# Altium schematic sheet Sheet1.SchDoc
size A3
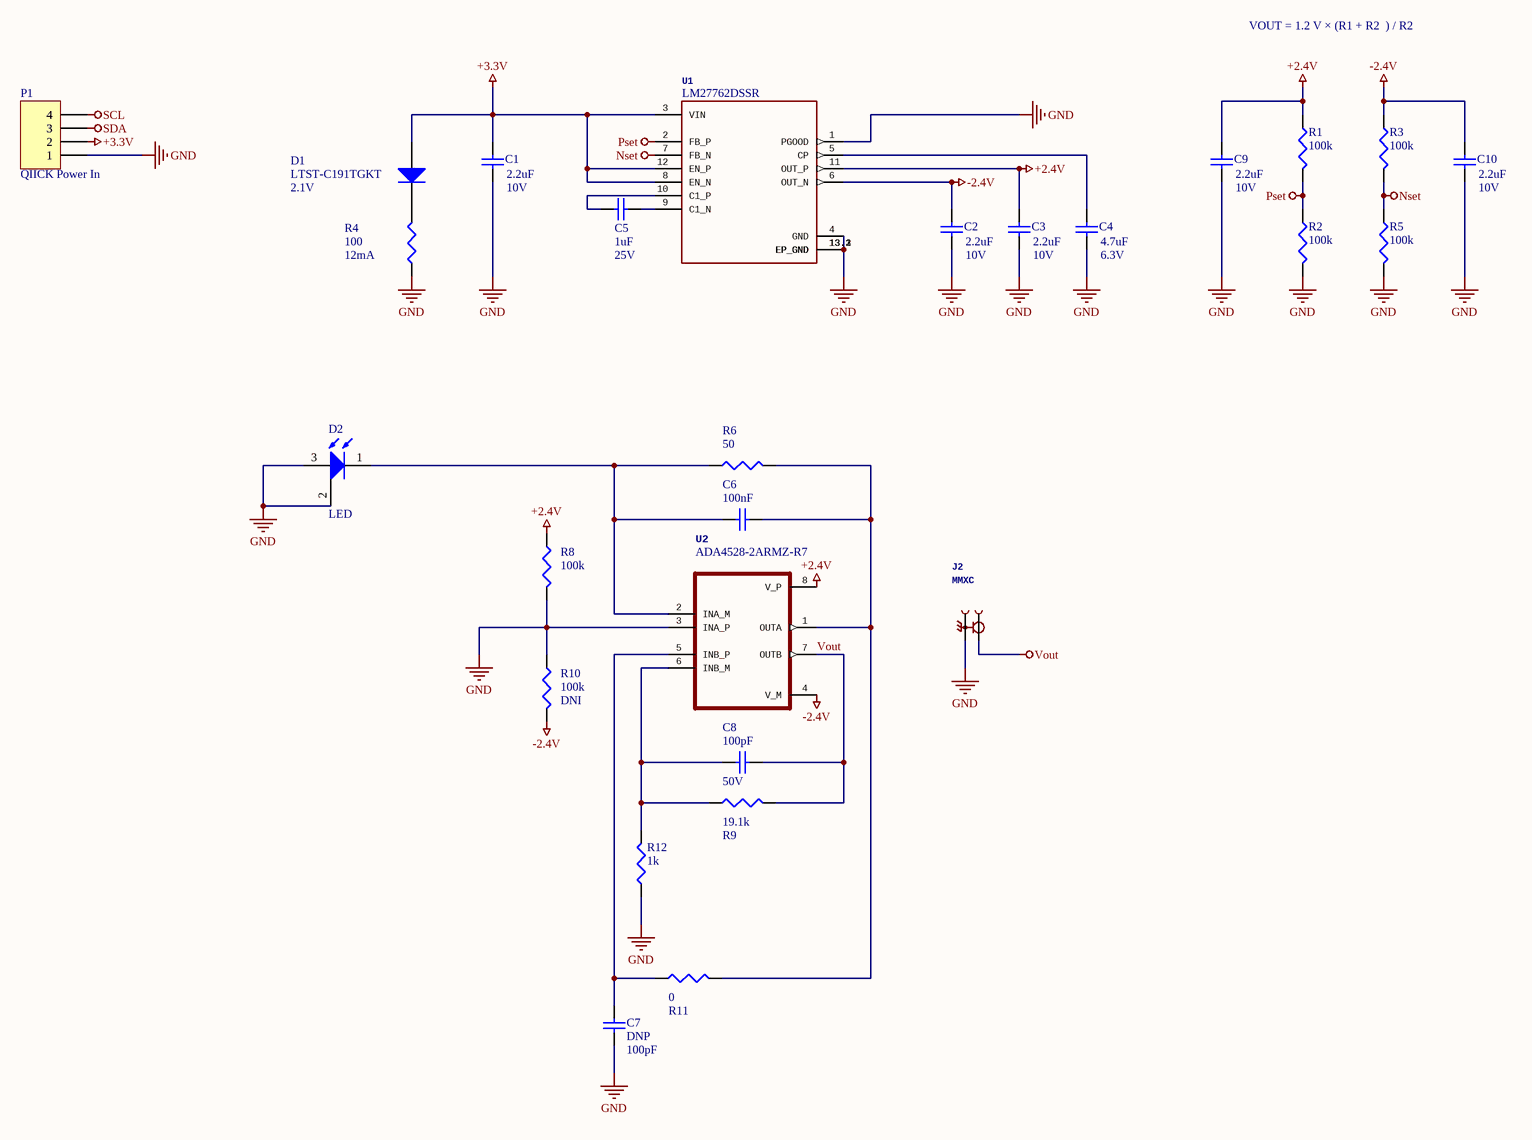
[diagram p0: Sheet1.SchDoc]

## Parts
C1  10V  value 2.2uF  [0402]
C2  10V  value 2.2uF  [0402]
C3  10V  value 2.2uF  [0402]
C4  6.3V  value 4.7uF  [0402]
C5  25V  value 1uF  [0402]
C6  value 100nF  [1608[0603]]  (hidden comment: Cap Semi)
C7  DNP  value 100pF  [J1-0603]
C8  50V  value 100pF  [1608[0603]]
C9  10V  value 2.2uF  [0402]
C10  10V  value 2.2uF  [0402]
D1  LTST-C191TGKT  Voltage: 2.1V  [1608[0603]]
D2  LED  [FD05D]
J2  MMXC  [LINX_CONMMCX001-SMD]
P1  QIICK Power In  [4P vert]
R1  value 100k  [1608[0603]]  (hidden comment: Res3)
R2  value 100k  [1608[0603]]  (hidden comment: Res3)
R3  value 100k  [1608[0603]]  (hidden comment: Res3)
R4  value 100  current: 12mA  [1608[0603]]  (hidden comment: Res3)
R5  value 100k  [1608[0603]]  (hidden comment: Res3)
R6  value 50  [1608[0603]]  (hidden comment: Res3)
R8  value 100k  [1608[0603]]  (hidden comment: DNI)
R9  value 19.1k  [J1-0603]  (hidden comment: Res3)
R10  DNI  value 100k  [1608[0603]]
R11  value 0  [J1-0603]  (hidden comment: Res3)
R12  value 1k  [J1-0603]  (hidden comment: Res3)
U1  Low-Noise Positive- and Negative-Output Charge Pump With Integrated LDO 12-WSON -40 to 85  [VREG_LM27762DSSR]  (value not drawn)
U2  Op Amp Dual GP R-R I/O ±2.75V/5.5V 8-Pin MSOP T/R Check availability  [SOP65P490X110-8N]  (value not drawn)

## Nets
+2.4V: C3.2 C9.2 R1.1 R8.1 U1.11(OUT_P) U2.8(V_P)
+3.3V: C1.2 D1.1(A) P1.2 U1.3(VIN) U1.8(EN_N) U1.12(EN_P)
-2.4V: C2.2 C10.2 R3.1 R10.2 U1.6(OUT_N) U2.4(V_M)
GND: C1.1 C2.1 C3.1 C4.1 C7.1 C9.1 C10.1 D2.2 D2.3(A) J2.2 P1.1 R2.2 R4.1 R5.2 R8.2 R10.1 R12.1 U1.1(PGOOD) U1.4(GND) U1.13(EP_GND) U1.13.1(EP_GND) U1.13.2(EP_GND) U1.13.3(EP_GND) U2.3(INA_P)
Nset: R3.2 R5.1 U1.7(FB_N)
Pset: R1.2 R2.1 U1.2(FB_P)
SCL: P1.4
SDA: P1.3
Vout: C8.2 J2.1 R9.2 U2.7(OUTB)
NetC4_2: C4.2 U1.5(CP)
NetC5_1: C5.1 U1.9(C1_N)
NetC5_2: C5.2 U1.10(C1_P)
NetC6_1: C6.1 D2.1(C) R6.1 U2.2(INA_M)
NetC6_2: C6.2 R6.2 R11.2 U2.1(OUTA)
NetC7_2: C7.2 R11.1 U2.5(INB_P)
NetC8_1: C8.1 R9.1 R12.2 U2.6(INB_M)
NetD1_2: D1.2(K) R4.2

## Notes on the sheet
- VOUT = 1.2 V × (R1 + R2  ) / R2

## Library data of the parts
C1-C3 C9 C10 = Cap: 2.2 µF ±20% 16V Ceramic Capacitor X6S 0402 (1005 Metric); Manufacturer Part #: CC0402MRX6S7BB225; Manufactuer: YAGEO
C4 = Cap: 4.7 µF ±20% 6.3V Ceramic Capacitor X6S 0402 (1005 Metric); Manufacturer Part #: CC0402MRX6S5BB475; Manufactuer: YAGEO; Footprints: *
C5 = Cap: 1 µF ±10% 25V Ceramic Capacitor X5R 0402 (1005 Metric); Manufacturer Part #: CC0402KPX5R8BB105; Manufactuer: YAGEO; Footprints: *
C6 = Cap Semi: 0.1 µF -20%, +80% 50V Ceramic Capacitor Y5V (F) 0603 (1608 Metric); Manufacturer: YAGEO; Manufacturer Part #: CC0603ZPY5V9BB104
C7 = Cap Semi: Capacitor (Semiconductor SIM Model); Do Not Install: DNI
C8 = Cap Semi: 100 pF ±5% 50V Ceramic Capacitor C0G, NP0 0603 (1608 Metric); Manufacturer: YAGEO; Manufacturer Part #: CC0603JPNPO9BN101
D1 = Diode: Green 525nm LED Indication - Discrete 3.2V 0603 (1608 Metric); Manufacturer: Lite-On Inc.; Manufacturer Part #: LTST-C191TGKT
D2 = Component_1: Do Not Install: DNI
J2 = CONMMCX001-SMD: MMCX Connector Receptacle, Female Socket 50Ohm Surface Mount Solder; Manufacturer: Linx Technologies Inc.; Manufacturer Part #: CONMMCX001-SMD
P1 = Header 4: Header, 4-PinConnector Header Surface Mount 4 position 0.039" (1.00mm); Manufacturer: JST Sales America Inc.; Manufacturer Part #: BM04B-SRSS-TB(LF)(SN)
R1-R3 R5 = Res3: 100 kOhms ±0.1% 0.1W, 1/10W Chip Resistor 0603 (1608 Metric) Thin Film; Manufacturer: YAGEO; Manufacturer Part #: RT0603BRD07100KL
R4 = Res3: 100 Ohms ±0.1% 0.1W, 1/10W Chip Resistor 0603 (1608 Metric) Thin Film; Manufacturer Part #: RT0603BRD07100RL; Manufacturer: YAGEO; power dissipated: 14mW
R6 = Res3: 50 Ohms ±0.1% 0.1W, 1/10W Chip Resistor 0603 (1608 Metric) Thin Film; Manufacturer: YAGEO; Manufacturer Part #: RT0603BRE0750RL
R8 R10 = Res3: Resistor; Do Not Install: DNI
R9 = Res3: 19.1 kOhms ±0.1% 0.1W, 1/10W Chip Resistor 0603 (1608 Metric) Thin Film; Manufacturer: YAGEO; Manufacturer Part #: RT0603BRD0719K1L
R11 = Res3: 0 Ohms Jumper Chip Resistor 0402 (1005 Metric) Moisture Resistant Thick Film; Manufacturer: YAGEO; Manufacturer Part #: RC0402FR-070RL
R12 = Res3: 1 kOhms ±0.1% 0.1W, 1/10W Chip Resistor 0603 (1608 Metric) Thin Film; Manufacturer: YAGEO; Manufacturer Part #: RT0603BRD071KL
U1 = LM27762DSSR: Charge Pump Switching Regulator IC Positive and Negative (Dual Rail) Adjustable -5V, 1.5V 2 - Dual Output 250mA 12-WFDFN Exposed Pad; Manufacturer: Texas Instruments; Manufacturer Part #: LM27762DSSR; Vendor: *; Vendor Part #: *
U2 = ADA4528-2ARMZ-R7: Zero-Drift Amplifier 2 Circuit Rail-to-Rail 8-MSOP; Manufacturer: Analog Devices; Manufacturer Part #: ADA4528-2ARMZ-R7